# Altium schematic sheet [06] USB_C.SchDoc: USB-C interface and USB mux
size A4; Engineer: M. Folejewski; DocumentNumber: 6; SheetNumber: 6; SheetTotal: 15; PageSize: A4; Designators: 200-249
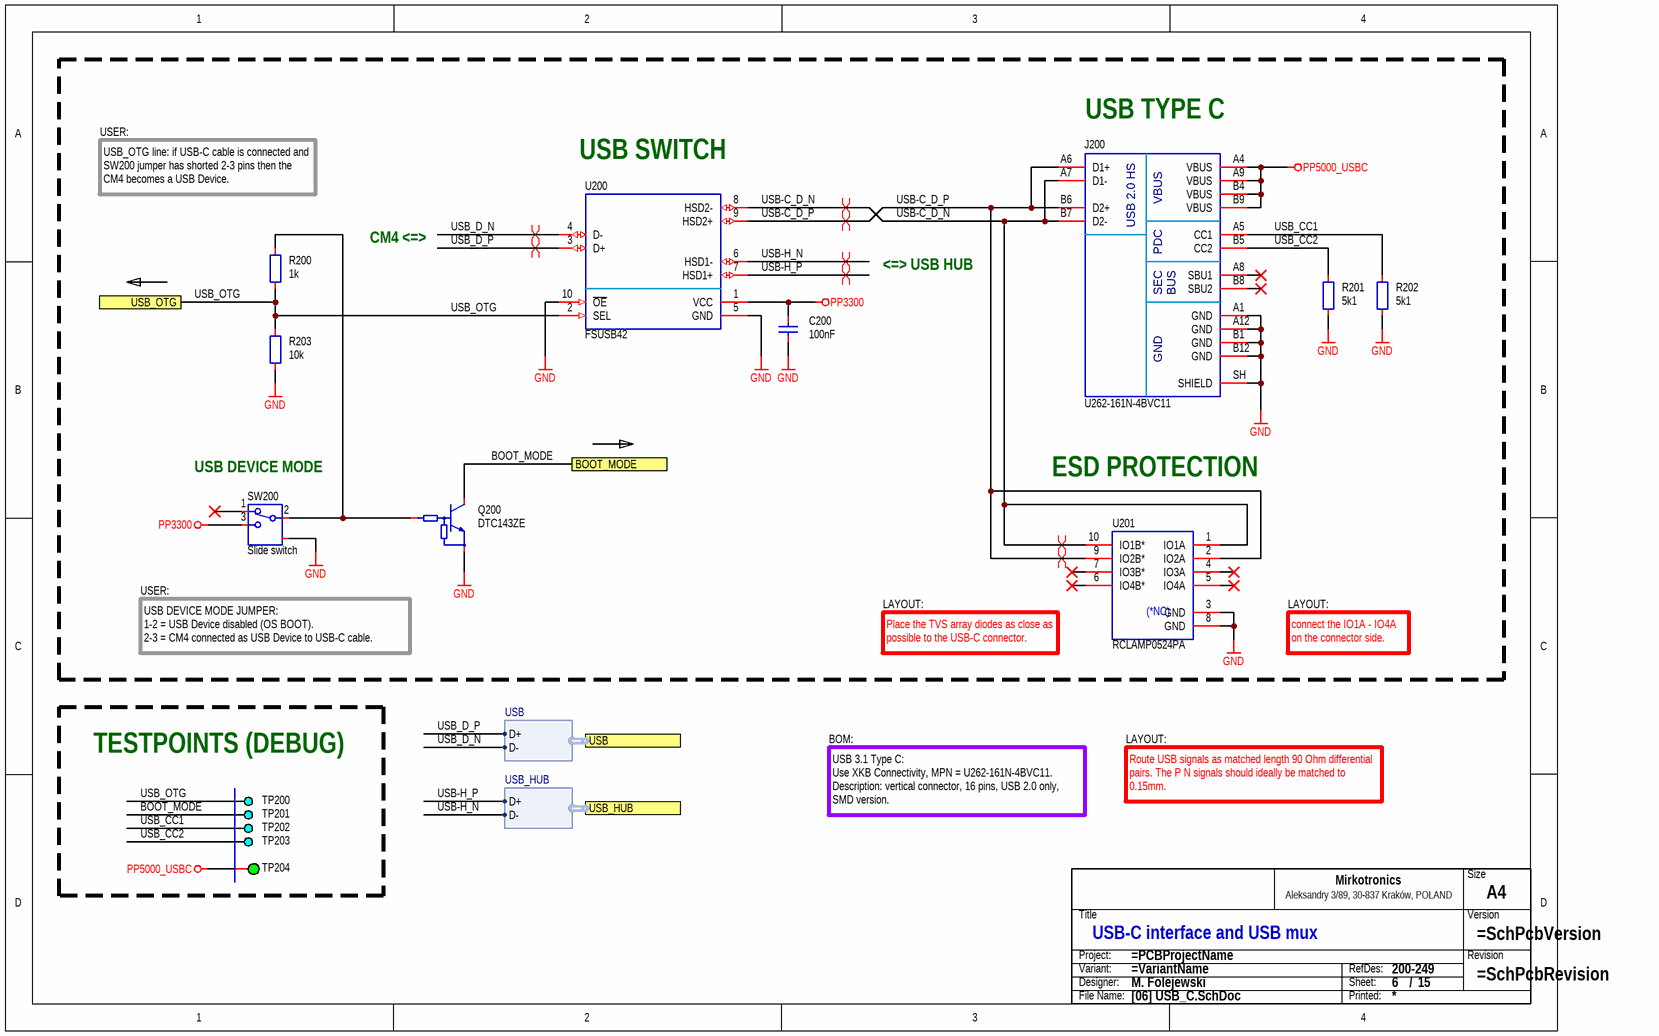
[diagram p0: [06] USB_C.SchDoc]

## Parts
C200  100nF  [CAP_0603_R]
J200  U262-161N-4BVC11  [CON_XKB_U262-161N-4BVC11]
Q200  DTC143ZE  [PKG_SOT523_SC75_SOT416_P100_R]
R200  1k  [RES_0603_R]
R201  5k1  [RES_0603_R]
R202  5k1  [RES_0603_R]
R203  10k  [RES_0603_R]
SW200  Slide switch  [SWI_XKB_SS-3292S-L1]
TB?  Title block  (value not drawn)  (graphical)
TP200  DEBUG  [PCB_TP_DBG_50]  (value not drawn)  (no BOM)
TP201  DEBUG  [PCB_TP_DBG_50]  (value not drawn)  (no BOM)
TP202  DEBUG  [PCB_TP_DBG_50]  (value not drawn)  (no BOM)
TP203  DEBUG  [PCB_TP_DBG_50]  (value not drawn)  (no BOM)
TP204  ICT  [PCB_TP_ICT_100]  (value not drawn)  (no BOM)
U200  FSUSB42  [ICC_MSOP10_300X300H110_P50_R]
U201  RCLAMP0524PA  [ICC_SLP2510P8_250X100X60_P50_R]

## Ports
BOOT_MODE, USB (harness USB), USB_HUB (harness USB_HUB), USB_OTG

## Harnesses
USB: D+, D-
USB_HUB: D+, D-

## Nets
GND: C200.1 J200.A1(GND) J200.A12(GND) J200.B1(GND) J200.B12(GND) J200.SH(SHIELD) Q200.2(E) R201.2 R202.2 R203.1 SW200.SH U200.5(GND) U200.10(~{OE}) U201.3(GND) U201.8(GND)
PP3300: C200.2 SW200.3 U200.1(VCC)
PP5000_USBC: J200.A4(VBUS) J200.A9(VBUS) J200.B4(VBUS) J200.B9(VBUS) TP204.1
BOOT_MODE: Q200.3(C) TP201.1 ; port BOOT_MODE
USB-C_D_N: J200.A7(D1-) J200.B7(D2-) U200.8(HSD2-) U201.1(IO1A) U201.10(IO1B*)
USB-C_D_P: J200.A6(D1+) J200.B6(D2+) U200.9(HSD2+) U201.2(IO2A) U201.9(IO2B*)
USB-H_N: U200.6(HSD1-) ; port USB_HUB.D-
USB-H_P: U200.7(HSD1+) ; port USB_HUB.D+
USB_CC1: J200.A5(CC1) R202.1 TP202.1
USB_CC2: J200.B5(CC2) R201.1 TP203.1
USB_D_N: U200.4(D-) ; port USB.D-
USB_D_P: U200.3(D+) ; port USB.D+
USB_OTG: R200.1 R203.2 TP200.1 U200.2(SEL) ; port USB_OTG
NetQ200_1: Q200.1(B) R200.2 SW200.2

Not connected (* = marked no-connect by the designer): J200 A8(SBU1)* B8(SBU2)*; SW200 1*; U201 4(IO3A)* 5(IO4A)* 6(IO4B*)* 7(IO3B*)*

## Layout directives
differential pair: USB-C_D_N, USB-C_D_P, USB-H_N, USB-H_P, USB_D_N, USB_D_P

## Notes on the sheet
- USER:
- (near U200) USB SWITCH
- (near J200) USB TYPE C
- USB_OTG line: if USB-C cable is connected and SW200 jumper has shorted 2-3 pins then the CM4 becomes a USB Device.
- CM4 <=>
- <=> USB HUB
- (near SW200) USB DEVICE MODE
- ESD PROTECTION
- USB DEVICE MODE JUMPER:
  1-2 = USB Device disabled (OS BOOT).
  2-3 = CM4 connected as USB Device to USB-C cable.
- Place the TVS array diodes as close as possible to the USB-C connector.
- LAYOUT:
- connect the IO1A - IO4A on the connector side.
- TESTPOINTS (DEBUG)
- BOM:
- USB 3.1 Type C:
  Use XKB Connectivity, MPN = U262-161N-4BVC11.
  Description: vertical connector, 16 pins, USB 2.0 only, SMD version.
- Route USB signals as matched length 90 Ohm differential pairs. The P N signals should ideally be matched to 0.15mm.
- (in symbol CON_USB_TYPE_C_16P) USB 2.0 HS; PDC; SEC; BUS
- (in symbol ICC-0005) (*NC)
- (in symbol SCH_TITLE_BLOCK_MIRKOTRONICS_V2) Size; Mirkotronics; Aleksandry 3/89, 30-837 Kraków, POLAND; Title; Version; Project:; Revision; Variant:; RefDes:; Designer:; Sheet:; /; File Name:; Printed:

## Library data of the parts
C200 = CAP-0008: Capacitor; MLCC; 100nF; TBD; TBD; TBD; TBD; SMD; 0603 (1608);; Component Type: Capacitor; Component Subtype: MLCC; Value: 100nF; Manufacturer: TBD; MPN: TBD; Mounting Type: SMD; Package (Case): 0603 (1608); Supplier: ?
J200 = CON_USB_TYPE_C_16P: Connector; USB 3.1 Type C; Receptacle; 24-pin; USB 2.0 Only;; Manufacturer: XKB Connectivity; Component Subtype: USB-C; Package (Case): SMD; Value: U262-161N-4BVC11; MPN: U262-161N-4BVC11; Component Type: Connector; Mounting Type: SMD; Supplier: ?
Q200 = TRA_BJT_NPN_DIG_BEC: Transistor; BJT; NPN; Digital;; Component Subtype: NPN Transistor; Value: DTC143ZE; MPN: DTC143ZE; Component Type: Transistor; Mounting Type: SMD; Supplier: ?
R200 = RES-0027: Resistor; Thick Film; 1k; 1%; 100mW; 100PPM; 75V; Standard; SMD; 0603 (1608);; Manufacturer: Yageo Corporation; MPN: TBD; Component Type: Resistor; Component Subtype: Thick Film; Value: 1k; Mounting Type: SMD; Package (Case): 0603 (1608); Supplier: ?
R201 R202 = RES-0043: Resistor; Thick Film; 5k1; 1%; 100mW; 100PPM; 75V; Standard; SMD; 0603 (1608);; Manufacturer: Yageo Corporation; MPN: TBD; Component Type: Resistor; Component Subtype: Thick Film; Value: 5k1; Mounting Type: SMD; Package (Case): 0603 (1608); Supplier: ?
R203 = RES-0028: Resistor; Thick Film; 10k; 1%; 100mW; 100PPM; 75V; Standard; SMD; 0603 (1608);; Manufacturer: Yageo Corporation; MPN: RC0603FR-0710KL; Component Type: Resistor; Component Subtype: Thick Film; Value: 10k; Mounting Type: SMD; Package (Case): 0603 (1608); Supplier: ?
SW200 = SWI_SPDT_3P_SH1: Switch; SPDT;; Manufacturer: XKB Connectivity; MPN: SS-3292S-L1; Package (Case): SMD; Component Subtype: Slide; Component Type: Switch; Mounting Type: SMD; Supplier: LCSC; Value: Slide switch
TB? = SCH_TITLE_BLOCK_MIRKOTRONICS_V2: Component Type: Title block; Manufacturer: -; Mounting Type: Non component; MPN: -; Operating Temperature: -; Package: -; Specification: Title block; Value: Title block; Replacement: -; System: ?
TP200-TP203 = PCB_TP_DBG: PCB Marking; Test Point (Debug);; Value: DEBUG; Component Subtype: -; Component Type: Testpoint; Mounting Type: -; Supplier: ?
TP204 = PCB_TP_ICT: Test Point (ICT); Specification: Testpoint (for ICT), SMD pad; Component Type: Testpoint (for ICT); Manufacturer: -; Mounting Type: Non component; MPN: -; Value: ICT
U200 = ICC-0013: IC; USB Switch; TBD TBD; SMD; MSOP-10;; Manufacturer: ON Semiconductor; MPN: FSUSB42MUX; Component Type: IC; Component Subtype: USB Switch; Value: FSUSB42; Mounting Type: SMD; Package (Case): MSOP-10; Supplier: ?
U201 = ICC-0005: IC; TVS Arrays; ESD Protection; 4-Channel; 17kV Air; 12kV Contact; 0.3pF Capitance; TBD; SMD; TBD;; Manufacturer: Semtech Corporation; MPN: RCLAMP0524PATCT; Component Type: IC; Component Subtype: TVS Arrays; Value: RCLAMP0524PA; Mounting Type: SMD; Package (Case): TBD; Supplier: ?